# Altium schematic sheet Buckschematic.SchDoc
size 420 x 297 mm; SheetNumber: 1; SheetTotal: 1
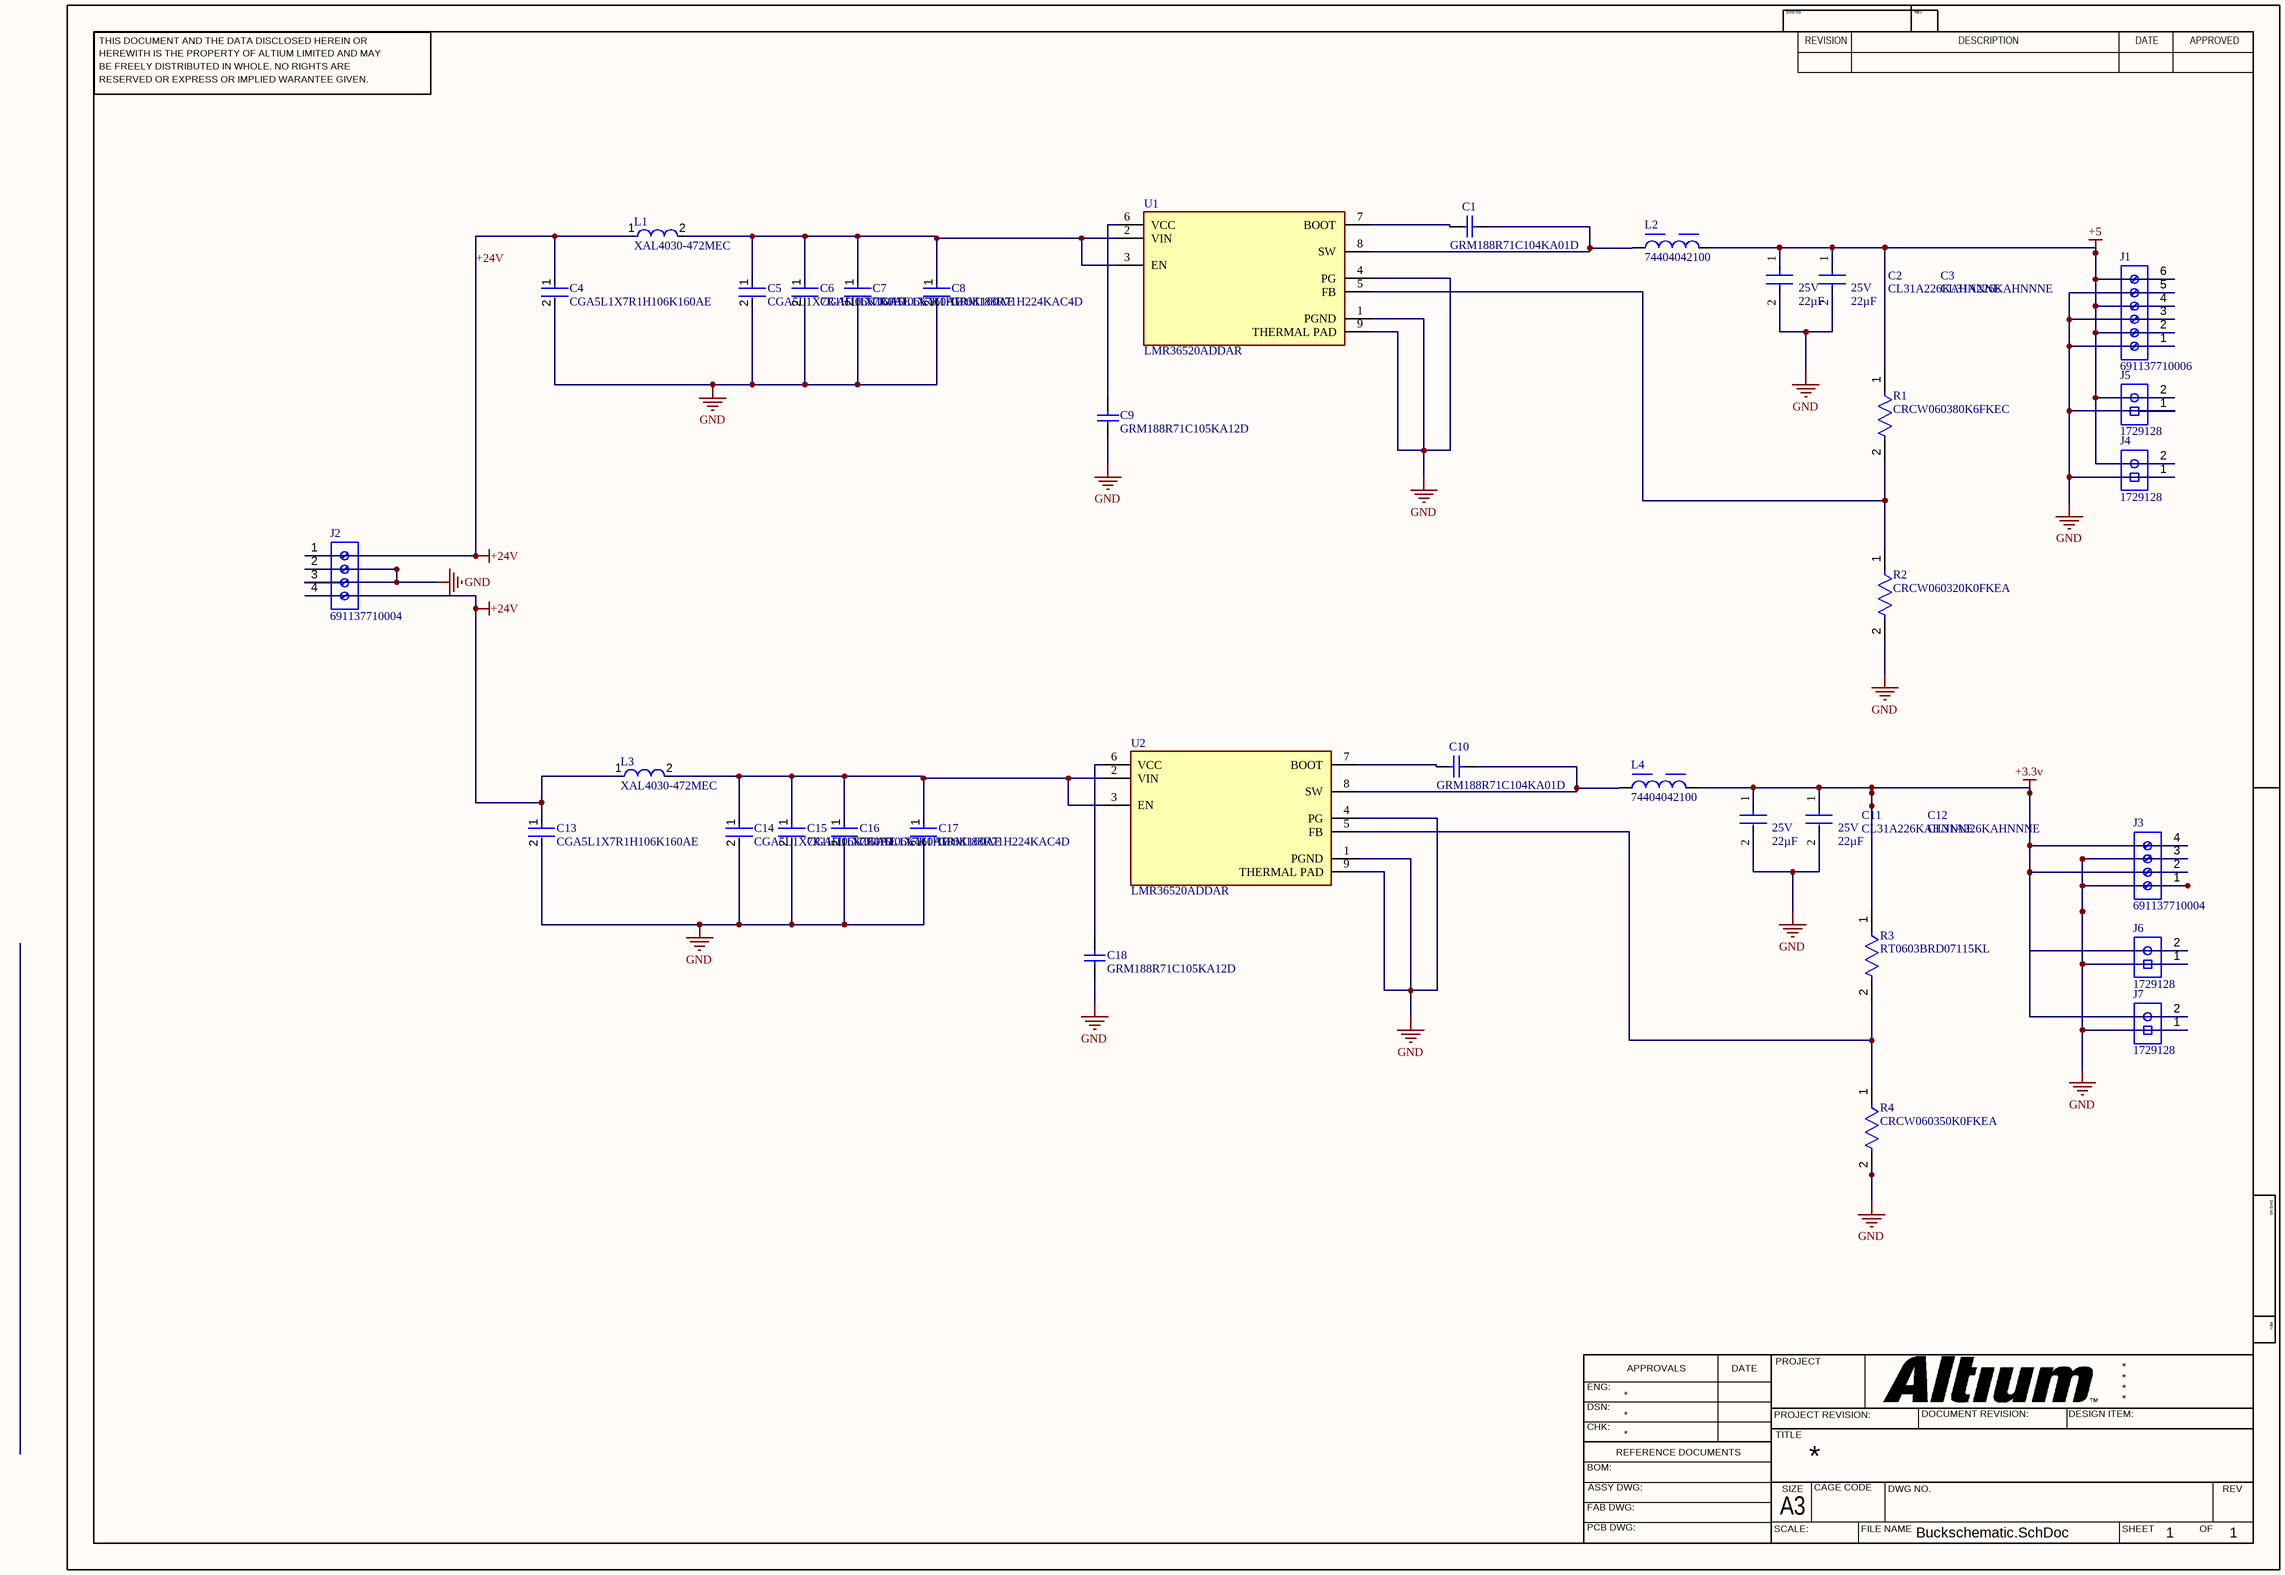
[diagram p0: Buckschematic.SchDoc]

## Parts
C1  GRM188R71C104KA01D  [MURA-0603_H_0.9_M]
C2  CL31A226KAHNNNE  [CL31H-0_2_MFG]
C3  CL31A226KAHNNNE  [CL31H-0_2_MFG]
C4  CGA5L1X7R1H106K160AE  [FP-CGA5L-0_3-0_1-IPC_C]
C5  CGA5L1X7R1H106K160AE  [FP-CGA5L-0_3-0_1-IPC_C]
C6  CGA5L1X7R1H106K160AE  [FP-CGA5L-0_3-0_1-IPC_C]
C7  CGA5L1X7R1H106K160AE  [FP-CGA5L-0_3-0_1-IPC_C]
C8  GRM188R71H224KAC4D  [FP-GRM188-0_1-e0_2_0_5-IPC_C]
C9  GRM188R71C105KA12D  [CAPC1608X90X35ML10T15]
C10  GRM188R71C104KA01D  [MURA-0603_H_0.9_M]
C11  CL31A226KAHNNNE  [CL31H-0_2_MFG]
C12  CL31A226KAHNNNE  [CL31H-0_2_MFG]
C13  CGA5L1X7R1H106K160AE  [FP-CGA5L-0_3-0_1-IPC_C]
C14  CGA5L1X7R1H106K160AE  [FP-CGA5L-0_3-0_1-IPC_C]
C15  CGA5L1X7R1H106K160AE  [FP-CGA5L-0_3-0_1-IPC_C]
C16  CGA5L1X7R1H106K160AE  [FP-CGA5L-0_3-0_1-IPC_C]
C17  GRM188R71H224KAC4D  [FP-GRM188-0_1-e0_2_0_5-IPC_C]
C18  GRM188R71C105KA12D  [CAPC1608X90X35ML10T15]
J1  691137710006  [691137710006]
J2  691137710004  [691137710004]
J3  691137710004  [691137710004]
J4  1729128  [PHOE-1729128-2_V]
J5  1729128  [PHOE-1729128-2_V]
J6  1729128  [PHOE-1729128-2_V]
J7  1729128  [PHOE-1729128-2_V]
L1  XAL4030-472MEC  [FP-XAL4030-472MEC-MFG]
L2  74404042100  [WE-LQS_4018]
L3  XAL4030-472MEC  [FP-XAL4030-472MEC-MFG]
L4  74404042100  [WE-LQS_4018]
R1  CRCW060380K6FKEC  [FP-CRCW0603-e3-MFG]
R2  CRCW060320K0FKEA  [FP-CRCW0603-e3-IPC_C]
R3  RT0603BRD07115KL  [FP-RT0603-MFG]
R4  CRCW060350K0FKEA  [FP-CRCW0603-e3-IPC_C]
U1  LMR36520ADDAR  [FP-DDA0008E-IPC_A]
U2  LMR36520ADDAR  [FP-DDA0008E-IPC_A]

## Nets
+3.3v: C11.1 C12.1 J3.2 J3.4 J6.2 J7.2 L4.2 R3.1
+5: C2.1 C3.1 J1.2 J1.4 J1.6 J4.2 J5.2 L2.2 R1.1
+24V: C4.1 C13.1 J2.1 J2.4 L1.1 L3.1
GND: C2.2 C3.2 C4.2 C5.2 C6.2 C7.2 C8.2 C9.2 C11.2 C12.2 C13.2 C14.2 C15.2 C16.2 C17.2 C18.2 J1.1 J1.3 J1.5 J2.2 J2.3 J3.1 J3.3 J4.1 J5.1 J6.1 J7.1 R2.2 R4.2 U1.1(PGND) U1.4(PG) U1.9(THERMAL_PAD) U2.1(PGND) U2.4(PG) U2.9(THERMAL_PAD)
NetC1_1: C1.1 U1.7(BOOT)
NetC1_2: C1.2 L2.1 U1.8(SW)
NetC5_1: C5.1 C6.1 C7.1 C8.1 L1.2 U1.2(VIN) U1.3(EN)
NetC9_1: C9.1 U1.6(VCC)
NetC10_1: C10.1 U2.7(BOOT)
NetC10_2: C10.2 L4.1 U2.8(SW)
NetC14_1: C14.1 C15.1 C16.1 C17.1 L3.2 U2.2(VIN) U2.3(EN)
NetC18_1: C18.1 U2.6(VCC)
NetR1_2: R1.2 R2.1 U1.5(FB)
NetR3_2: R3.2 R4.1 U2.5(FB)

## Notes on the sheet
- THIS DOCUMENT AND THE DATA DISCLOSED HEREIN OR
- HEREWITH IS THE PROPERTY OF ALTIUM LIMITED AND MAY
- DWG NO:
- REVISION
- REV:
- DESCRIPTION
- DATE
- APPROVED
- BE FREELY DISTRIBUTED IN WHOLE. NO RIGHTS ARE
- RESERVED OR EXPRESS OR IMPLIED WARANTEE GIVEN.
- ENG:
- APPROVALS
- PROJECT
- DSN:
- CHK:
- REFERENCE DOCUMENTS
- PROJECT REVISION:
- TITLE
- DOCUMENT REVISION:
- DESIGN ITEM:
- BOM:
- FAB DWG:
- PCB DWG:
- ASSY DWG:
- SCALE:
- A3
- SIZE
- CAGE CODE
- FILE NAME
- DWG NO.
- SHEET
- OF
- REV

## Library data of the parts
C1 C10 = CMP-2000-05253-1: CAP, Ceramic, 0.1 uF, 10%, 16 V, 0603, RoHS, Tape and Reel; Manufacturer: Murata; Capacitance - pF: 100000pF; Case Length: 1.6mm; Voltage Rating DC: 16V; Brand: MurataElectronics; Temperature Coefficient / Code: +/-15%; Case Width: 0.8mm; Type: GeneralPurposeMLCC; Capacitance: 0.1uF; Dielectric: X7R; Capacitance - nF: 100nF; Product Category: MultilayerCeramicCapacitorsMLCC-SMD/SMT; Datasheet URL: https://datasheet.ciiva.com/29202/451467-da-01-en-vs-kondensator-0603-29202287.pdf; Termination Style: SMD/SMT; Operating Temperature Range: -55Cto+125C; Case Code - in: 0603; Datasheet Version: Dec-10; Dimensions: 0.8mmWx1.6mmLx0.8mmH; RoHS: Details; Case Code - mm: 1608; Product: GeneralTypeMLCCs; Voltage Rating: 16V; Package / Case: 0603(1608metric); Factory Pack Quantity: 4000; Packaging: Reel; Maximum Operating Temperature: +125C; Manufacturer URL: http://www.murata.com/; Case Height: 0.8mm; Minimum Operating Temperature: -55C; Series: GRM; Tolerance: 10%
C2 C3 C11 C12 = CMP-13271-000012-2: Ceramic Capacitor, Multilayer, Ceramic, 25V, 10% +Tol, 10% -Tol, X5R, 15% TC, 22uF, Surface Mount, 1206; Capacitance: 22µF; Material: Ceramic; RoHS: Compliant; Dielectric: X5R; HelpURL: https://product.samsungsem.com/mlcc/CL31A226KAHNNN.do; Max Operating Temperature: 85°C; Tolerance: 10%; Voltage Rating (DC): 25V; ComponentLink2Description: Datasheet URL; Voltage Rating: 25V; Min Operating Temperature: -55°C; ComponentLink2URL: https://product.samsungsem.com/mlcc/CL31A226KAHNNN.do; Case/Package: 1206; Height: 1.8mm
C4-C7 C13-C16 = CMP-08246-000430-1: Cap Ceramic 10uF 50V X7R 10% Pad SMD 1206 +125°C Automotive T/R
C8 C17 = CMP-06035-003691-1: Chip Multilayer Ceramic Capacitors for General Purpose, 0603, 0.22uF, X7R, 15%, 10%, 50V; Capacitance: 220nF; Lead Free: Lead Free; Packaging: Tape and Reel; Max Operating Temperature: 125°C; Tolerance: 10%; Case Code (Imperial): 0603; Case/Package: 0603; Thickness: 0.035inch; Case Code (Metric): 1608; Voltage Rating (DC): 50V; Width: 0.031inch; Mount: Surface Mount; Voltage Rating: 50V; Length: 0.063inch; Min Operating Temperature: -55°C
C9 C18 = CMP-2006-02845-1: Manufacturer: Murata; Part Number: GRM188R71C105KA12D
J1 = CMP-1502-03328-2: NexarPartId: 78871143; Current Rating: 16A; Number of Contacts: 6; Voltage Rating: 300V; Max Operating Temperature: 120°C; Packaging: Box; Number of Rows: 1; Number of Pins: 6; Min Operating Temperature: -30°C; Contact Material: Nickel, Tin; RoHS: Non-Compliant; Height: 11.6mm; Lead Pitch: 5mm
J2 J3 = CMP-1502-03326-2: NexarPartId: 78871140; Packaging: Box; RoHS: Non-Compliant; Number of Pins: 4; Lead Pitch: 5mm
J4-J7 = CMP-2000-05815-1: PCB Terminal Block, 13.5 A, 400 V, 2-Pin THD, RoHS, Bulk; Manufacturer: Phoenix Contact; Package Version: 03/2015; No. of Rows: 1; Pitch: 5.08mm; No. of Positions: 2; Voltage Rating: 400V; Current Rating: 13500mA; Manufacturer URL: http://www.phoenixcontact.com/; Datasheet URL: https://datasheet.ciiva.com/16046/1729128-16046181.pdf; RoHS: TRUE; Package URL: https://www.phoenixcontact.com/online/portal/pi/pxc/product_detail_page/!ut/p/b1/3VdJjqNKFDxLH8AFycySyWY2ozFsEPOMMQaDOX1XedGL_1Vdm5YXJleknhSKeBkvI6EA8ncAo3AYoDhBQGco6KN7VURTdemj9us_IEKEZo_YHiPAEWEFmDGOHMORkqKYCORBZxgL7ZoaZYcbFFUZ3fqxSY6GOuxydWUuHqz1ynmMFygu583Bob0Ewr6Sd_l-5m-kAueHiB0jpRwZwe58wwtkpxtMYd_LmGcDRU02dRNEyWt6Y2ti5pSyJ_reIkzIulrqApdnbT11V5jnCKbYNCvhEM1MCpPByat_X379-iThf08CI5GfOPqfBeS3BRoBOdD55AKVv0iLwCMq-2BrzXWSGRH7pUGD9uwXQjiph3xL0DKQwdGa0JImiIOmBNOestqgwTHSSs2oOep-78apyXQBvNi8ZLaFjvjWvcaUEBu0MC6Wbe-d6mB0FAebo2lUWinqYaZs5DAYzV0RP9yitUjnGJ0iI9xhZkT42OCQNUJJhkgWINNQLP2JFP6OpMg3JCVg70jqHT0lvKOnhHf0lPuOnnLf0VPuWx6_dxwUIvwk5WMkT0kLL1mh61l2yZVSzG3pYV_bqo-mj6uMKwKwdnnW8Jh5RTOJzMOA5c-eJDaZQw4mTMPH02PvS_ZAqNVjVTo2WyYLkwH_KU1mmmG5kjRhDqPXLwwVHvVOjCM60-fpXvTDfMGW1PVFVS1r4e4yVDk4ZdNbkUHvqPqQSeian4UD39fNKmachqdJ1NJbyk8rXT9mXTvPk3oE5meulKGgiruPJek-4I9hTT6G8ZLOyRSm2RRVbThERQad5OS28hdt4YW4vG0stgYYzsWsK4_7y6DZMjJSCqri1kyiZR5vD7pwIrNR7QwPHTcLTI5qT7eRlpHrdGiupYlqQDJ7zy_CND8fWWBoLRXxk1RVcXiBQwbTD4Xi7KL-FuO94t9xaqweXzH; PartNumber: 1729128; Package Description: 2-Pin Through Hole Device, Body 8.1 x 10.16 mm, Pitch 5.08 mm; Datasheet Version: 12/2013; Mounting Technology: ThroughHole; Orientation: Horizontal; Package Reference: 1729128-2; Packing: Bulk
L1 L3 = CMP-11268-000082-1: Power Inductor (SMD), 4.7 µH, 5.1 A, Shielded, 4.5 A, XAL40xx Series, 4mm x 4mm x 3.1mm; Tolerance: 20%; DC Resistance (DCR): 44.1mR; Inductance: 4.7uH; Saturation Current: 4.5A; Max DC Current: 5.1A; Self Resonant Frequency: 36MHz; Test Frequency: 100kHz; Core Material: Composite; REACH SVHC: No SVHC; Height: 3.1mm; Package Quantity: 500; Width: 4.3mm; Mount: Surface Mount; RoHS Compliant: Yes; Case/Package: SMD/SMT; Length: 4.3mm; Packaging: Tape and Reel; Max Operating Temperature: 125°C; Min Operating Temperature: -40°C; Series: XAL4030; Termination: SMD/SMT; Inductance Tolerance: 20%; Shielding: Shielded; RMS Current (Irms): 5.1A; Lead Free: Contains Lead
L2 L4 = CMP-1354-00028-2: NexarPartId: 46948255; Saturation Current: 1.5A; Tolerance: 20%; Current Rating: 1.2A; Core Material: Ferrite; Test Frequency: 100kHz; Series Resistance: 180mΩ; Shielding: Shielded; DC Resistance (DCR): 150mΩ; Self Resonant Frequency: 28MHz; Inductance: 10µH; Mount: Surface Mount; Inductance Tolerance: 20%; RoHS: Compliant; Composition: Wirewound; Max DC Current: 1.2A; Height: 1.8mm; Ambient Temperature Range High: 85°C; Height - Seated (Max): 1.8034mm; Width: 4mm; Packaging: Tape & Reel (TR); Case/Package: Nonstandard; Ambient Temperature Range Low: -40°C; Termination: SMD/SMT; Min Operating Temperature: -40°C; Length: 4mm; REACH SVHC: Unknown; RMS Current (Irms): 1.2A; Max Operating Temperature: 125°C
R1 = CMP-02407-002214-1: RES Thick Film, 80.6kΩ, 1%, 0.1W, 100ppm/°C, 0603; Max Power Dissipation: 100mW; Resistance: 80.6kR; Temperature Coefficient: 100ppm/°C; Tolerance: 1%; Width: 0.033inch; Lead Free: Lead Free; Length: 0.061inch; Max Operating Temperature: 155°C; Composition: Thick Film; Package Quantity: 20000; Number of Terminations: 2; Packaging: Tape and Reel; Case/Package: 0603; Height: 0.02inch; Min Operating Temperature: -55°C; Features: Automotive AEC-Q200
R2 = CMP-2000-03068-2: RES Thick Film, 20kΩ, 1%, 0.1W, 100ppm/°C, 0603; Voltage Rating: 75V; Power Rating: 100mW; Resistance: 20kR; Lead Free: Lead Free; Depth: 0.85mm; Case Code (Metric): 1608; Contact Plating: Tin; Max Operating Temperature: 155°C; Package Quantity: 5000; Length: 1.55mm; Min Operating Temperature: -55°C; Composition: Thick Film; Case/Package: 0603; Packaging: Tape and Reel; Tolerance: 1%; Width: 0.85mm; Termination: SMD/SMT; Military Standard: Not; Case Code (Imperial): 0603; Voltage Rating (DC): 75V; Temperature Coefficient: 100ppm/°C; Radiation Hardening: No; Weight: 7.1E-05oz; Height: 0.45mm; Number of Pins: 2; Mount: Surface Mount
R3 = CMP-03412-024509-1: RES SMD 115K OHM 0.1% 1/10W 0603; Manufacturer: Yageo; Power Rating: 0.1W; Value: 115KΩ; Tolerance: 0.001; Temperature Coefficient: 25 ppm/°C; Voltage Rating: 75V; Mouser Description: Res Thin Film 0603 115K Ohm 0.1% 1/10W ±25ppm/°C Molded SMD SMD Paper T/R; Temperature Range High: +155°C; Device Class L2: Resistors; Digikey Description: RES SMD 115K OHM 0.1% 1/10W 0603; Automotive: No; Temperature: -55°C to +155°C; Footprint Url: http://www.yageo.com/exep/pages/download/literatures/PYu-R_Mount_10.pdf; Height: 0.55mm; Device Class L1: Passive Components; Device Class L3: Chip SMD Resistors; ComponentLink2Description: Datasheet; Resistance: 115KΩ; Manufacturer Part Number: RT0603BRD07115KL; Composition: Thin Film; ComponentLink2URL: http://www.yageo.com/documents/recent/PYu-RT_1-to-0.01_RoHS_L_9.pdf; Series: RT; Octopart: https://octopart.com/rt0603brd07115kl-yageo-1461905; Category: Res; RoHS: TRUE; Temperature Range Low: -55°C; Lead Free: Yes; Package: RT0603; Ipc Land Pattern Name: RESC16080X45
R4 = CMP-02407-003705-1: RES Thick Film, 50kΩ, 1%, 0.1W, 100ppm/°C, 0603
U1 U2 = CMP-04918-000502-1: IC DC/DC BUCK CONVERTER 65V 2A